# EasyEDA Pro project ProPrj_辉光管时钟V1.0_2025-10-09.epro, schematic 电源部分
Create Date: 2024-01-13; Page Name: P1; Project Name: 辉光管时钟成品; Schematic Name: 电源部分; Update Date: 2024-01-18; Company: 嘉立创EDA; Page Size: A3; Version: V1.0
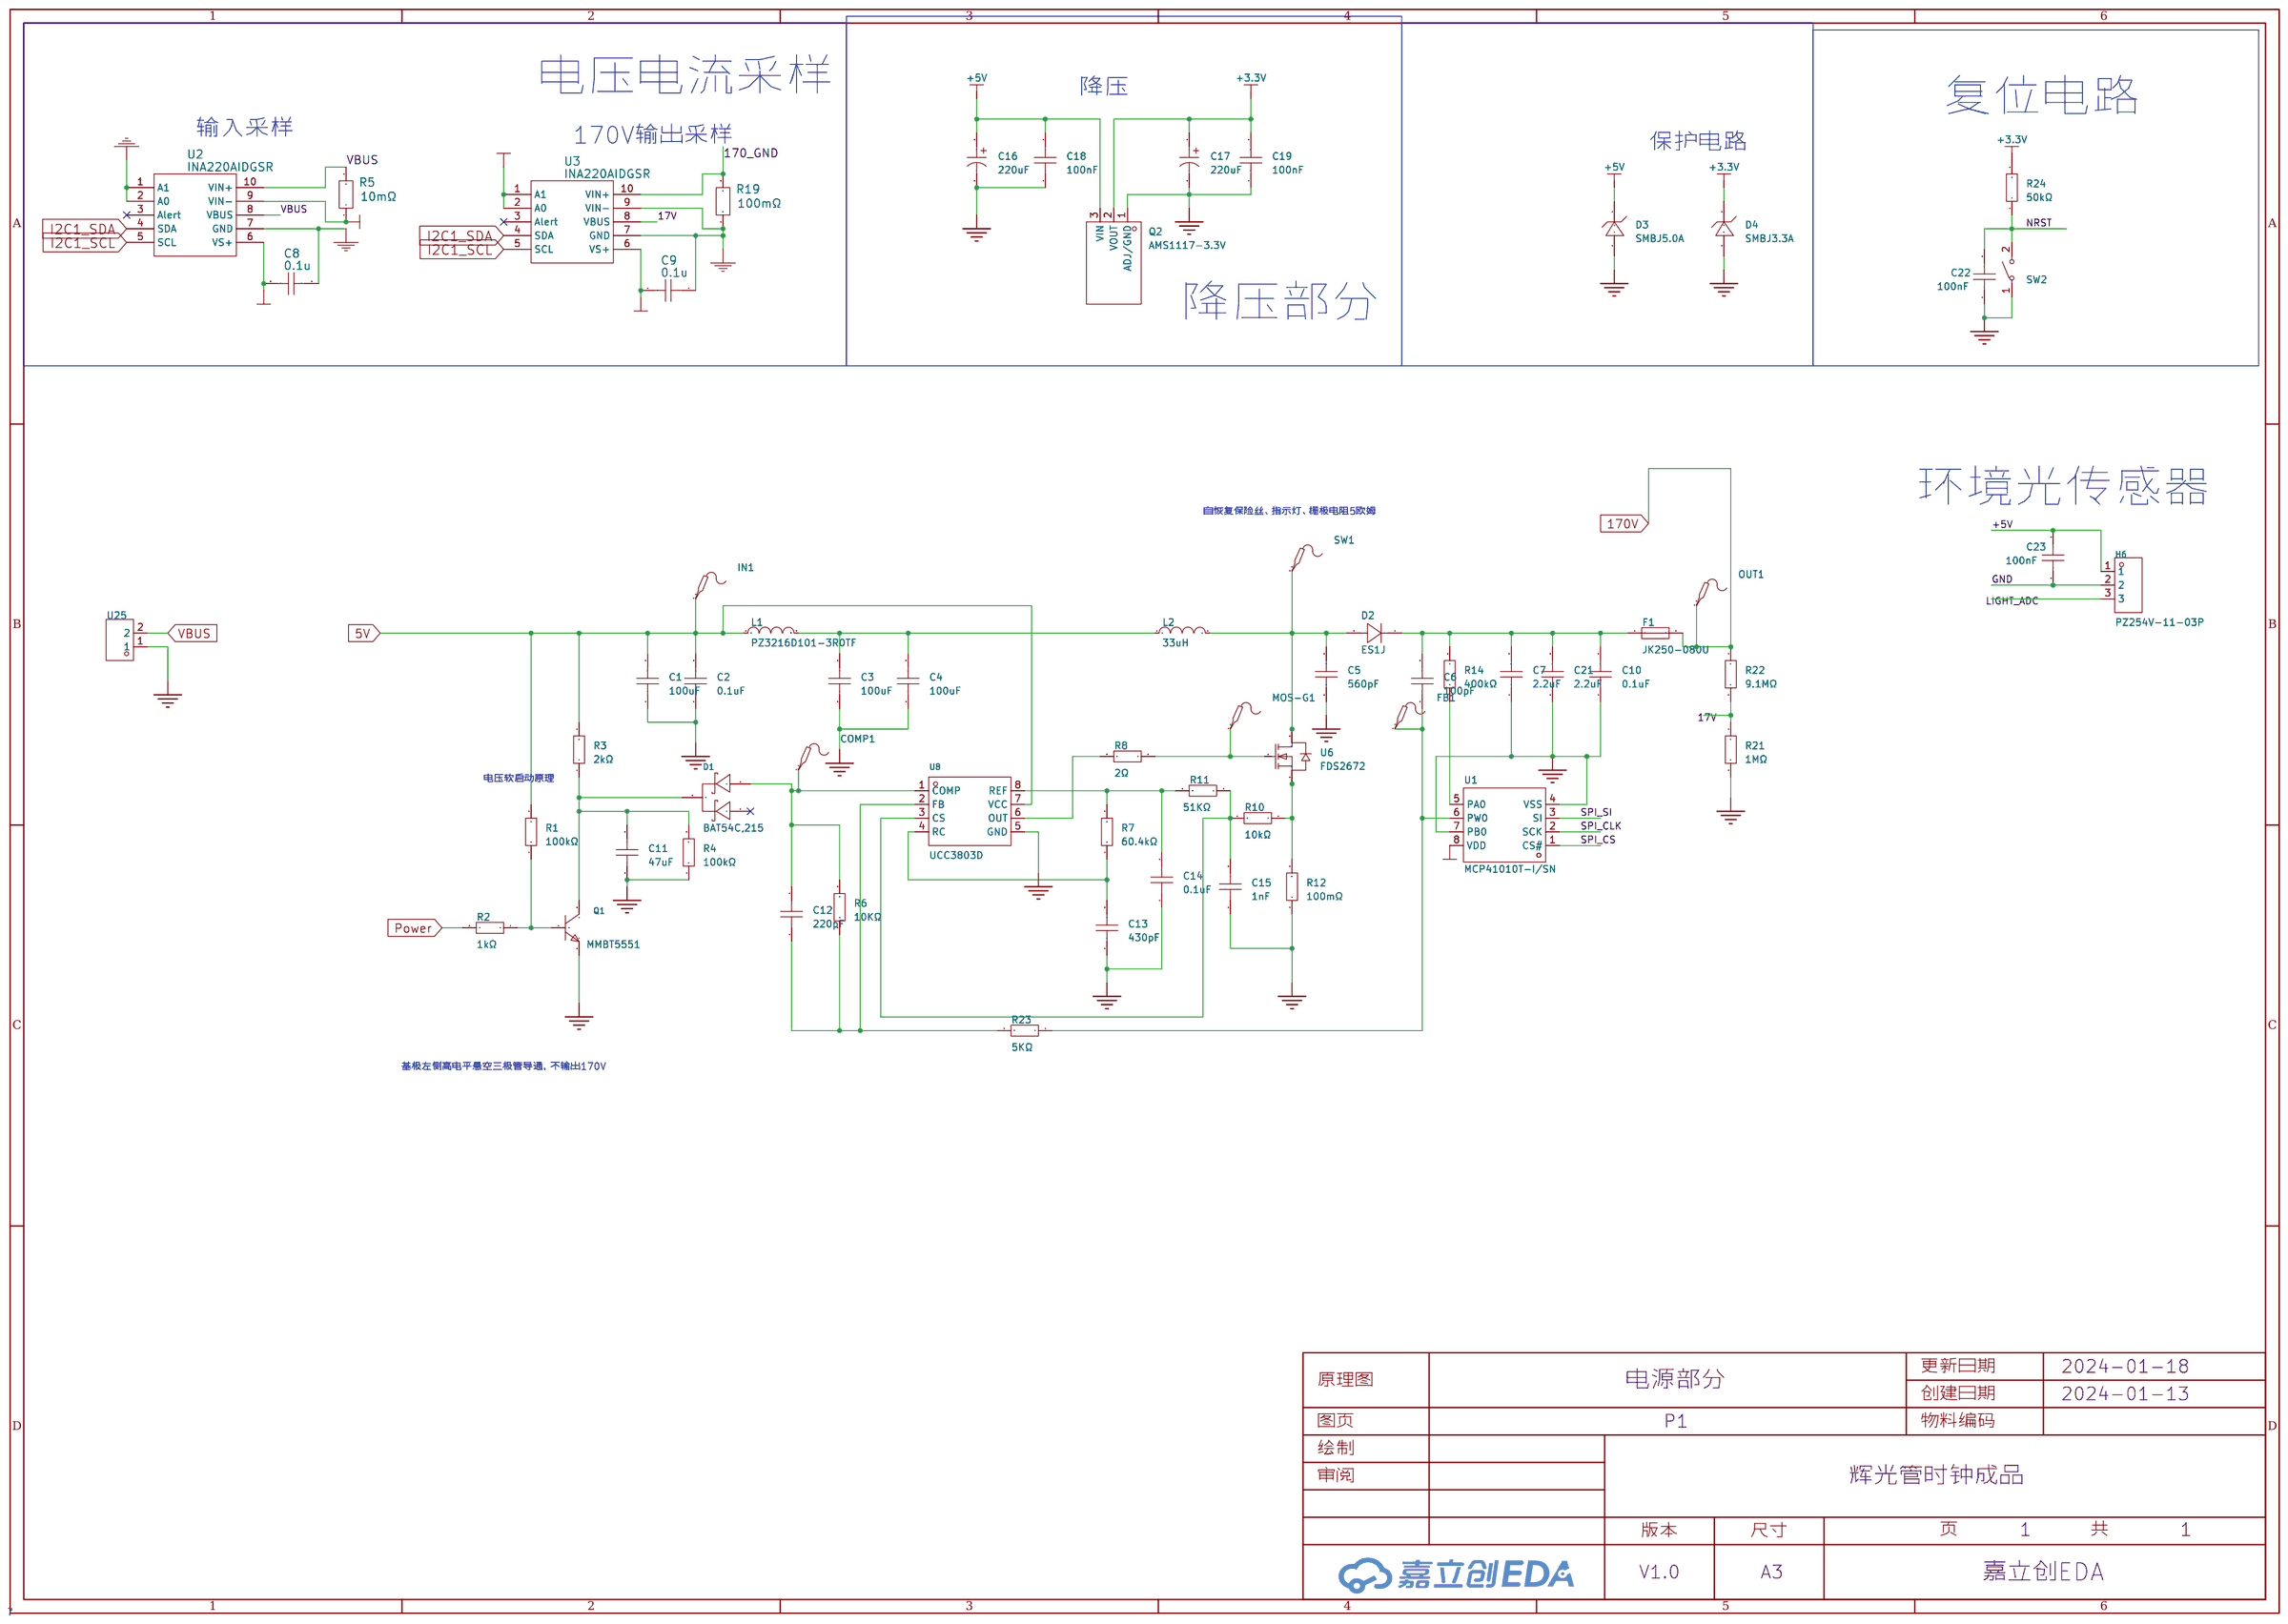
[diagram p3: schematic sheet]

## Parts
C1  100uF  [c1206]
C2  0.1uF  [c0603]
C3  100uF  [c1206]
C4  100uF  [c1206]
C5  560pF  [c1206]
C6  100pF  [C0805]
C7  2.2uF  [c1210]
C8  0.1u  [C0603]
C9  0.1u  [C0603]
C10  0.1uF  [c1206]
C11  47uF  [c0603]
C12  220pF  [c0603]
C13  430pF  [c0603]
C14  0.1uF  [c0603]
C15  1nF  [c0603]
C16  220uF  [CAP-SMD_BD6.3-L6.6-W6.6-FD]
C17  220uF  [CAP-SMD_BD6.3-L6.6-W6.6-FD]
C18  100nF  [C0603]
C19  100nF  [C0603]
C21  2.2uF  [c1210]
C22  100nF  [C0603]
C23  100nF  [C0603]
COMP1  -  [Test-Point-0.5mm]
D1  BAT54C,215  [SOT-23-3_L2.9-W1.6-P1.90-LS2.8-BR]
D2  ES1J  [sod-123_l2.7-w1.6-ls3.6-rd]
D3  SMBJ5.0A  [SMB_L4.4-W3.6-LS5.3-RD]
D4  SMBJ3.3A  [SMB_L4.6-W3.6-LS5.3-RD]
F1  JK250-080U  [FUSE-TH_L5.8-W3.8-P5.10-D0.8]
FB1  -  [Test-Point-0.5mm]
H6  PZ254V-11-03P  [HDR-TH_3P-P2.54-V-M]
IN1  -  [Test-Point-0.5mm]
L1  10uH  [l0603]
L2  33uH  [33uh功率电感]
MOS-G1  -  [Test-Point-0.5mm]
OUT1  -  [Test-Point-0.5mm]
Q1  MMBT5551  [SOT-23-3_L2.9-W1.3-P1.90-LS2.4-BR]
Q2  AMS1117-3.3V  [SOT-89-3_L4.5-W2.5-P1.50-LS4.2-BR]
R1  100kΩ  [r0603]
R2  1kΩ  [r0603]
R3  2kΩ  [r0603]
R4  100kΩ  [r0603]
R5  10mΩ  [R0805]
R6  10KΩ  [r0603]
R7  60.4kΩ  [r0603]
R8  2Ω  [r0603]
R10  10kΩ  [r0603]
R11  51KΩ  [r0603]
R12  100mΩ  [R0805]
R14  400kΩ  [r0603]
R19  100mΩ  [R0805]
R21  1MΩ  [r0603]
R22  9.1MΩ  [r0603]
R23  5KΩ  [r0603]
R24  50kΩ  [r0603]
SW1  -  [Test-Point-0.5mm]
SW2  TS-1088R-02026  [SW-SMD_L3.9-W3.0-P4.45]
U1  MCP41010T-I/SN  [SOIC-8_L4.9-W3.9-P1.27-LS6.0-BL]
U2  INA220AIDGSR  [VSSOP-10_L3.0-W3.0-P0.50-LS4.9-BL]
U3  INA220AIDGSR  [VSSOP-10_L3.0-W3.0-P0.50-LS4.9-BL]
U6  FDS2672  [SO-8_L4.9-W3.9-P1.27-LS6.0-BL]
U8  UCC3803D  [SOIC-8_L4.9-W3.9-P1.27-LS6.0-BL]
U25  -  [2.54mm1*2]

## Library data of the parts
C1-C4 C6 C10-C15 = CC0805KRX7R9BB104: 容值:100nF;精度:±10%;额定电压:50V;材质(温度系数):X7R;; LCSC Part Name: 100nF ±10% 50V; Supplier Part: C49678; Manufacturer: YAGEO(国巨); Supplier Footprint: 0805; JLCPCB Part Class: Basic Part; Datasheet: https://atta.szlcsc.com/upload/public/pdf/source/20151026/1457707504898.pdf; Supplier: LCSC; Tolerance: ±10%; Voltage Rated: 50V; Temperature Coefficient: X7R
C5 = CC0805KRX7R9BB104: 容值:100nF;精度:±10%;额定电压:50V;材质(温度系数):X7R;; LCSC Part Name: 100nF ±10% 50V; Supplier Part: C49678; Manufacturer: YAGEO(国巨); Supplier Footprint: 1206; JLCPCB Part Class: Basic Part; Datasheet: https://atta.szlcsc.com/upload/public/pdf/source/20151026/1457707504898.pdf; Supplier: LCSC; Tolerance: ±10%; Voltage Rated: 50V; Temperature Coefficient: X7R
C7 C21 = CC0805KRX7R9BB104: 容值:100nF;精度:±10%;额定电压:50V;材质(温度系数):X7R;; LCSC Part Name: 100nF ±10% 50V; Supplier Part: C49678; Manufacturer: YAGEO(国巨); Supplier Footprint: 0805; JLCPCB Part Class: Basic Part; Datasheet: https://atta.szlcsc.com/upload/public/pdf/source/20151026/1457707504898.pdf; Supplier: LCSC; Tolerance: ±10%; Voltage Rated: 200V; Temperature Coefficient: X7R
C8 C9 = 0.1u
C16 C17 = RVT220UF10V67RV0037: 容值:220uF;精度:±20%;额定电压:10V;纹波电流:69mA@120Hz;等效串联电阻:-;; LCSC Part Name: 220uF ±20% 10V; Supplier Part: C2833309; Manufacturer: KNSCHA(科尼盛); Supplier Footprint: SMD,D6.3xL5.4mm; JLCPCB Part Class: Extended Part; Datasheet: https://atta.szlcsc.com/upload/public/pdf/source/20210521/C2833309_008BCE4BC4FC60DA08096FEE6338ABBD.pdf; Supplier: LCSC; Tolerance: ±20%; Rated Voltage: 10V; Ripple Current: 69mA@120Hz; φD: 6.3mm; L: 5.4mm; Lifetime @ Temp: 2000hrs@105℃; Operating Temperature: -55℃~+105℃
C18 C19 C22 C23 = CC0603KRX7R9BB104: 容值:100nF;精度:±10%;额定电压:50V;材质(温度系数):X7R;; LCSC Part Name: 100nF ±10% 50V; Supplier Part: C14663; Manufacturer: YAGEO(国巨); Supplier Footprint: 0603; JLCPCB Part Class: Basic Part; Datasheet: https://atta.szlcsc.com/upload/public/pdf/source/20180910/C282072_33301C7F631E79921B82A8DAC6BCC5B3.pdf; Supplier: LCSC; Tolerance: ±10%; Voltage Rated: 50V; Temperature Coefficient: X7R
COMP1 FB1 IN1 MOS-G1 OUT1 SW1 = Test-Point: Test Point 测试点
D1 = BAT54C,215: 二极管配置:1对共阴极;直流反向耐压(Vr):30V;平均整流电流(Io):200mA;正向压降(Vf):800mV@100mA;; LCSC Part Name: 电压:30V 电流:200mA; Supplier Part: C37704; Manufacturer: Nexperia(安世); Supplier Footprint: SOT-23(TO-236); JLCPCB Part Class: Basic Part; Datasheet: https://atta.szlcsc.com/upload/public/pdf/source/20161024/1477288736847.pdf; Supplier: LCSC; Diode Configuration: 1对共阴极; Reverse Voltage (Vr): 30V; Average Rectified Current (Io): 200mA; Forward Voltage (Vf@If): 800mV@100mA; Reverse Leakage Current (Ir): 2uA@25V
D2 = ES1J_C691230: 正向压降(Vf):1.3V @ 1A;平均整流电流(Io):1A;直流反向耐压(Vr):600V;二极管配置:独立式;工作结温(Tj):-55℃~+150℃;工作结温(Tj):-55℃~+150℃;反向电流(Ir):5uA @ 600V;反向恢复时间(trr):35ns;; Supplier Part: C691230; Manufacturer: DIODES(美台); Supplier Footprint: SMA; JLCPCB Part Class: Extended Part; Datasheet: https://atta.szlcsc.com/upload/public/pdf/source/20200628/C691230_6EC9ACEA5CE84292BBF501D48DE20532.pdf; Supplier: LCSC
D3 = SMBJ5.0A_C726811: 极性：单向 反向截止电压(Vrwm)：5V 击穿电压：6.4V 最大钳位电压：9.2V; Supplier Part: C726811; Manufacturer: TWGMC(台湾迪嘉); Supplier Footprint: SMB; JLCPCB Part Class: Extended Part; Datasheet: https://atta.szlcsc.com/upload/public/pdf/source/20200901/C726811_07201DC3516E92FF13903A0BAE18F725.pdf; Supplier: LCSC
D4 = SMBJ3.3A_C362089: 反向截止电压(Vrwm):3.3V;击穿电压:4.1V;最大钳位电压:7.3V;; LCSC Part Name: 单向TVS 3.3V截止 600W峰值脉冲功率; Supplier Part: C362089; Manufacturer: JKSEMI(金开盛); Supplier Footprint: SMB(DO-214AA); JLCPCB Part Class: Extended Part; Datasheet: https://atta.szlcsc.com/upload/public/pdf/source/20200731/C362089_3B984BF84356FE4A5051ADB3F5B1E766.pdf; Supplier: LCSC; Unidirectional Channels: 1; Bidirectional Channels: 0; Reverse Stand-Off Voltage (Vrwm): 3.3V; Breakdown Voltage: 4.1V; Maximum Clamping Voltage: 7.3V; Peak Pulse Power Dissipation (Ppp)@10/1000us: 600W
F1 = JK250-080U: 最大电压:250V;最大电流:3A;保持电流:80mA;跳闸电流:160mA;; LCSC Part Name: 250V 80mA 插件自恢复; Supplier Part: C369127; Manufacturer: JK(金科); Supplier Footprint: 插件; JLCPCB Part Class: Extended Part; Datasheet: https://atta.szlcsc.com/upload/public/pdf/source/20190402/C369127_E7230E1328F96C53474DAC88A9C5A944.pdf; Supplier: LCSC; Operating Voltage (Max): 250V; Current Rating (Max): 3A; Hold Current: 80mA; Trip Current: 160mA; Maximum Time to Trip: 500ms
H6 = PZ254V-11-03P: 排数:单排;总PIN位数:3;间距:2.54mm;插针结构:1x3P;行距:-;安装类型:直插;圆针/方针:方针;额定电流:3A;额定电压:250V;配合针长度:6mm;塑高:2.5mm;端接针长度:3mm;工作温度范围:-40℃~+105℃;颜色:黑色;; LCSC Part Name: 2.54mm 1x3P 直插 方针; Supplier Part: C2937625; Manufacturer: XFCN(兴飞); Supplier Footprint: 直插,P=2.54mm; JLCPCB Part Class: Extended Part; Datasheet: 2022-07-12/581362A/62b9d00620994b3696be7eb4af85ad72/双排排针和单排排针.pdf; Supplier: LCSC; Number of Rows: 单排; Number of Pins: 3; Pitch: 2.54mm; Pin Structure: 1x3P; Mounting Type: 直插; Circluar Pins/Square Pins: 方针; Current Rating (Max): 3A; Voltage Rating (Max): 250V; Length of Mating Pin: 6mm; Insulation Height: 2.5mm; Length of End Connection Pin: 3mm; Operating Temperature Range: -40℃~+105℃; Color: 黑色
L1 = PZ3216D101-3R0TF: 标称阻抗@测试频率:100Ω@100MHz;误差:±25%;直流电阻(RDC):-;; LCSC Part Name: 单路 1206磁珠 阻抗100Ω@100MHz; Supplier Part: C370089; Manufacturer: Sunlord(顺络); Supplier Footprint: 1206; JLCPCB Part Class: Extended Part; Datasheet: https://atta.szlcsc.com/upload/public/pdf/source/20210816/2FE48A83668C9496AD98DE44B7F0FA96.pdf; Supplier: LCSC; Impedance @ Frequency: 100Ω@100MHz; Tolerance: ±25%; Current Rating: 3A; Circuits: 1
L2 = CXP0630-330M-AG(33uh): 类型:一体成型电感;电感值:33uH;精度:±20%;额定电流:2A;饱和电流(Isat):2.5A;; LCSC Part Name: 33uH ±20% 2.5A; Supplier Part: C7461364; Manufacturer: DMBJ(振宝佳); Supplier Footprint: 0630; Datasheet: https://atta.szlcsc.com/upload/public/pdf/source/20230706/7F3A5B39C5AD80A91C9FA782B54A296B.pdf; Supplier: LCSC; Type: 一体成型电感; Tolerance: ±20%; Rated Current: 2A; Saturation Current (Isat): 2.5A; DC Resistance (DCR): 240mΩ
Q1 = MMBT5551_C2145: 晶体管类型:NPN;集射极击穿电压(Vceo):160V;集电极电流(Ic):600mA;功率(Pd):300mW;直流电流增益(hFE@Ic,Vce):200@10mA,5V;; LCSC Part Name: NPN 160V 600mA G1 H档200-300; Supplier Part: C2145; Manufacturer: CJ(江苏长电/长晶); Supplier Footprint: SOT-23; JLCPCB Part Class: Basic Part; Datasheet: https://atta.szlcsc.com/upload/public/pdf/source/20140809/1457707209203.pdf; Supplier: LCSC; Transistor Type: NPN; Collector-Emitter Breakdown Voltage (Vceo): 160V; Collector Current (Ic): 600mA; Power Dissipation (Pd): 300mW; Collector Cut-Off Current (Icbo): 50nA; Collector-Emitter Saturation Voltage (VCE(sat)@Ic,Ib): 200mV@50mA,5mA; DC Current Gain (hFE@Ic,Vce): 200@10mA,5V; Transition Frequency (fT): 100MHz; Operating Temperature: +150℃@(Tj)
Q2 = AMS1117-3.3V_C5120796: 输出类型:固定;最大输入电压:18V;输出电压:3.3V;最大输出电流:1A;输出极性:正极;; LCSC Part Name: 输入18V 输出3.3V 1A; Supplier Part: C5120796; Manufacturer: MSKSEMI(美森科); Supplier Footprint: SOT-89; JLCPCB Part Class: Extended Part; Datasheet: https://atta.szlcsc.com/upload/public/pdf/source/20231123/6117526697EB8BF6175FDEEBA0877266.pdf; Supplier: LCSC; Output Type: 固定; Maximum Input Voltage: 18V; Output Voltage: 3.3V; MAX Output Current: 1A; Dropout Voltage: 1.4V@(1A); standby current: 12mA; Operating Temperature: 0℃~+125℃; Output Polarity: 正极; Number of Outputs: 1
R1-R4 R6-R8 R10 R11 R14 R21-R24 = 0805W8F1002T5E_C17414: 电阻类型:厚膜电阻;阻值:10kΩ;精度:±1%;功率:125mW;; LCSC Part Name: 10kΩ ±1% 125mW; Supplier Part: C17414; Manufacturer: UNI-ROYAL(厚声); Manufacturer Part: 0805W8F1002T5E; Supplier Footprint: 0805; JLCPCB Part Class: Basic Part; Datasheet: https://atta.szlcsc.com/upload/public/pdf/source/20200306/C422600_1E6D84923E4A46A82E41ADD87F860B5C.pdf; Supplier: LCSC; Type: 厚膜电阻; Tolerance: ±1%; Power(Watts): 125mW; Temperature Coefficient: ±100ppm/℃; Overload Voltage (Max): 150V; Operating Temperature Range: -55℃~+155℃
R5 R19 = 5mΩ
R12 = RL10FTNR160: 阻值:160mΩ;精度:±1%;; LCSC Part Name: 160mΩ ±1%; Supplier Part: C5138985; Manufacturer: 大毅科技; Supplier Footprint: 0805; JLCPCB Part Class: Extended Part; Datasheet: https://atta.szlcsc.com/upload/public/pdf/source/20220824/9B3755BD17A966410CFA156DB04E8A1C.pdf; Supplier: LCSC; Tolerance: ±1%; Type: 厚膜电阻; Power(Watts): 125mW; Temperature Coefficient: ±100ppm/℃; Overload Voltage (Max): 150V; Operating Temperature Range: -55℃~+155℃
SW2 = TS-1088R-02026: 电路结构:单刀单掷;按钮形状:圆形按钮;开关长度:3.9mm;开关宽度:2.93mm;开关高度:2mm;触点电流:50mA;额定电压(DC):12V;安装方式:立贴;带灯:-;机械寿命:-;; LCSC Part Name: 3.9*2.93*2mm 立贴 轻触开关; Supplier Part: C455280; Manufacturer: XUNPU(讯普); Supplier Footprint: SMD,3x4mm; JLCPCB Part Class: 扩展库; Datasheet: https://atta.szlcsc.com/upload/public/pdf/source/20191118/C455281_EC5379764BC1462550DF64BBBFEA9579.pdf; Supplier: LCSC; Circuit: 单刀单掷; Actuator Style: 圆形按钮; Switch Length: 3.9mm; Switch Width: 2.93mm; Switch Height: 2mm; Contact Current: 50mA; Voltage Rating (DC): 12V; Mounting Style: 立贴
U1 = MCP41010T-I/SN: 供电电压:2.7V~5.5V;电阻值(欧姆):10kΩ;精度:±20%;接口类型:SPI;; Supplier Part: C136395; Manufacturer: MICROCHIP(美国微芯); Supplier Footprint: SOP-8; JLCPCB Part Class: Extended Part; Datasheet: https://atta.szlcsc.com/upload/public/pdf/source/20220205/C2666606_C5E8E7A5F3891B321C1555D845654E7B.pdf; Supplier: LCSC; Supply Voltage: 2.7V~5.5V; Resistance Value (Ohms): 10kΩ; Number of Taps: 256; Temperature Coefficient (Typ): 800ppm/℃; Precision: ±20%; Number of Channels: 1; Interface Type: SPI; Operating Temperature: -40℃~+85℃
U2 U3 = INA220AIDGSR: INA220 26V、双向、零漂移、低侧/高侧、I2C 输出电流/功率监控器; Supplier Part: C543040; Manufacturer: TI(德州仪器); Supplier Footprint: VSSOP-10-0.5mm; JLCPCB Part Class: Extended Part; Datasheet: https://www.ti.com/cn/lit/gpn/ina220; Supplier: LCSC; image: //image.lceda.cn/szlcsc/C49851.jpg
U6 = FDS2672: 类型:N沟道;漏源电压(Vdss):200V;连续漏极电流(Id):3.9A;功率(Pd):2.5W;导通电阻(RDS(on)@Vgs,Id):70mΩ@10V,3.9A;; LCSC Part Name: N沟道 200V 3.9A N 沟道，UltraFET Trench MOSFET，200V，3.9A，70mΩ; Supplier Part: C463724; Manufacturer: onsemi(安森美); Supplier Footprint: SO-8; JLCPCB Part Class: Extended Part; Datasheet: https://atta.szlcsc.com/upload/public/pdf/source/20221020/30635B57EECFDD9AF98E52E6F77A9868.pdf; Supplier: LCSC; Type: N沟道; Drain Source Voltage (Vdss): 200V; Continuous Drain Current (Id): 3.9A; Power Dissipation (Pd): 2.5W; Drain Source On Resistance (RDS(on)@Vgs,Id): 70mΩ@10V,3.9A; Gate Threshold Voltage (Vgs(th)@Id): 4V@250uA; Total Gate Charge (Qg@Vgs): 46nC@10V; Input Capacitance (Ciss@Vds): 2.535nF@100V; Operating Temperature: -55℃~+150℃@(Tj)
U8 = UCC3803D: 功能类型:升压型；降压型；升降压型;输出通道数:1;输入电压:3.6V~12V;开关频率:31kHz;; Supplier Part: C701477; Manufacturer: TI(德州仪器); Supplier Footprint: SOP-8; JLCPCB Part Class: Extended Part; Datasheet: https://www.ti.com/cn/lit/gpn/ucc3800; Supplier: LCSC; Function: 升压型；降压型；升降压型; Number of Outputs: 1; Input Voltage: 3.6V~12V; Synchronous Rectification: 否; Topology: 反激式；降压式；正激式；升压式; Switching Frequency: 31kHz; Duty Cycle (Max): 99%; Operating Temperature: 0℃~+70℃@(TA)
U25 = 排针

## Nets
5V: C1.2 C2.2 C8.2 C9.2 IN1.1 L1.1 R1.2 R3.2 R5.1 U1.8(VDD) U2.6(VS+) U2.9(VIN-) U3.1(A1) U3.2(A0) U3.6(VS+) U8.7(VCC)
17V: R21.1 R22.2 U3.8(VBUS)
170V: F1.2 OUT1.1 R22.1
+3.3V: C17.1 C19.2 D4.1 Q2.2(VOUT) R24.2
+5V: C16.1 C18.2 C23.2 D3.1(C) H6.1 Q2.3(VIN)
GND: C1.1 C2.1 C3.1 C4.1 C5.1 C7.1 C8.1 C9.1 C10.1 C11.1 C13.1 C14.1 C15.1 C16.2 C17.2 C18.1 C19.1 C21.1 C22.1 C23.1 D3.2(A) D4.2 H6.2 Q1.2(E) Q2.1(ADJ/GND) R4.1 R12.1 R19.1 R21.2 SW2.1 U1.4(VSS) U1.7(PB0) U2.1(A1) U2.2(A0) U2.7(GND) U3.7(GND) U3.9(VIN-) U8.5(GND) U25.1
VBUS: R5.2 U2.8(VBUS) U2.10(VIN+) U25.2
170_GND: R19.2 U3.10(VIN+)
I2C1_SCL: U2.5(SCL) U3.5(SCL)
I2C1_SDA: U2.4(SDA) U3.4(SDA)
LIGHT_ADC: H6.3
NRST: C22.2 R24.1 SW2.2
Power: R2.2
SPI_CLK: U1.2(SCK)
SPI_CS: U1.1(CS#)
SPI_SI: U1.3(SI)
$1N2815: Q1.1(B) R1.1 R2.1
$1N2823: C13.2 R7.1 U8.4(RC)
$1N2825: MOS-G1.1 R8.1 U6.4(G)
$1N2826: R8.2 U8.6(OUT)
$1N2828: C5.2 D2.2(A) L2.2 SW1.1 U6.5(D) U6.6(D) U6.7(D) U6.8(D)
$1N2831: R10.1 R12.2 U6.1(S) U6.2(S) U6.3(S)
$1N2832: C15.2 R10.2 R11.1 U8.3(CS)
$1N2833: C14.2 R7.2 R11.2 U8.8(REF)
$1N2845: C11.2 D1.3(K) Q1.3(C) R3.1 R4.2
$1N2846: C12.2 COMP1.1 D1.1(A) R6.2 U8.1(COMP)
$1N2851: C3.2 C4.2 L1.2 L2.1
$1N3400: C6.2 C7.2 C10.2 C21.2 D2.1(K) F1.1 R14.2
$1N3681: C12.1 R6.1 R23.2 U8.2(FB)
$1N3760: R14.1 U1.5(PA0)
$1N3770: C6.1 FB1.1 R23.1 U1.6(PW0)

Not connected (* = marked no-connect by the designer): D1 2(A)*; U2 3(Alert)*; U3 3(Alert)*

## Notes on the sheet
- 电压电流采样
- 降压
- 复位电路
- 输入采样
- 170V输出采样
- 保护电路
- 降压部分
- 自恢复保险丝、指示灯、栅极电阻5欧姆
- 环境光传感器
- 电压软启动原理
- 基极左侧高电平悬空三极管导通，不输出170V
